# EAGLE design GH_Terra_one_side_corr (EAGLE 6.5.0)
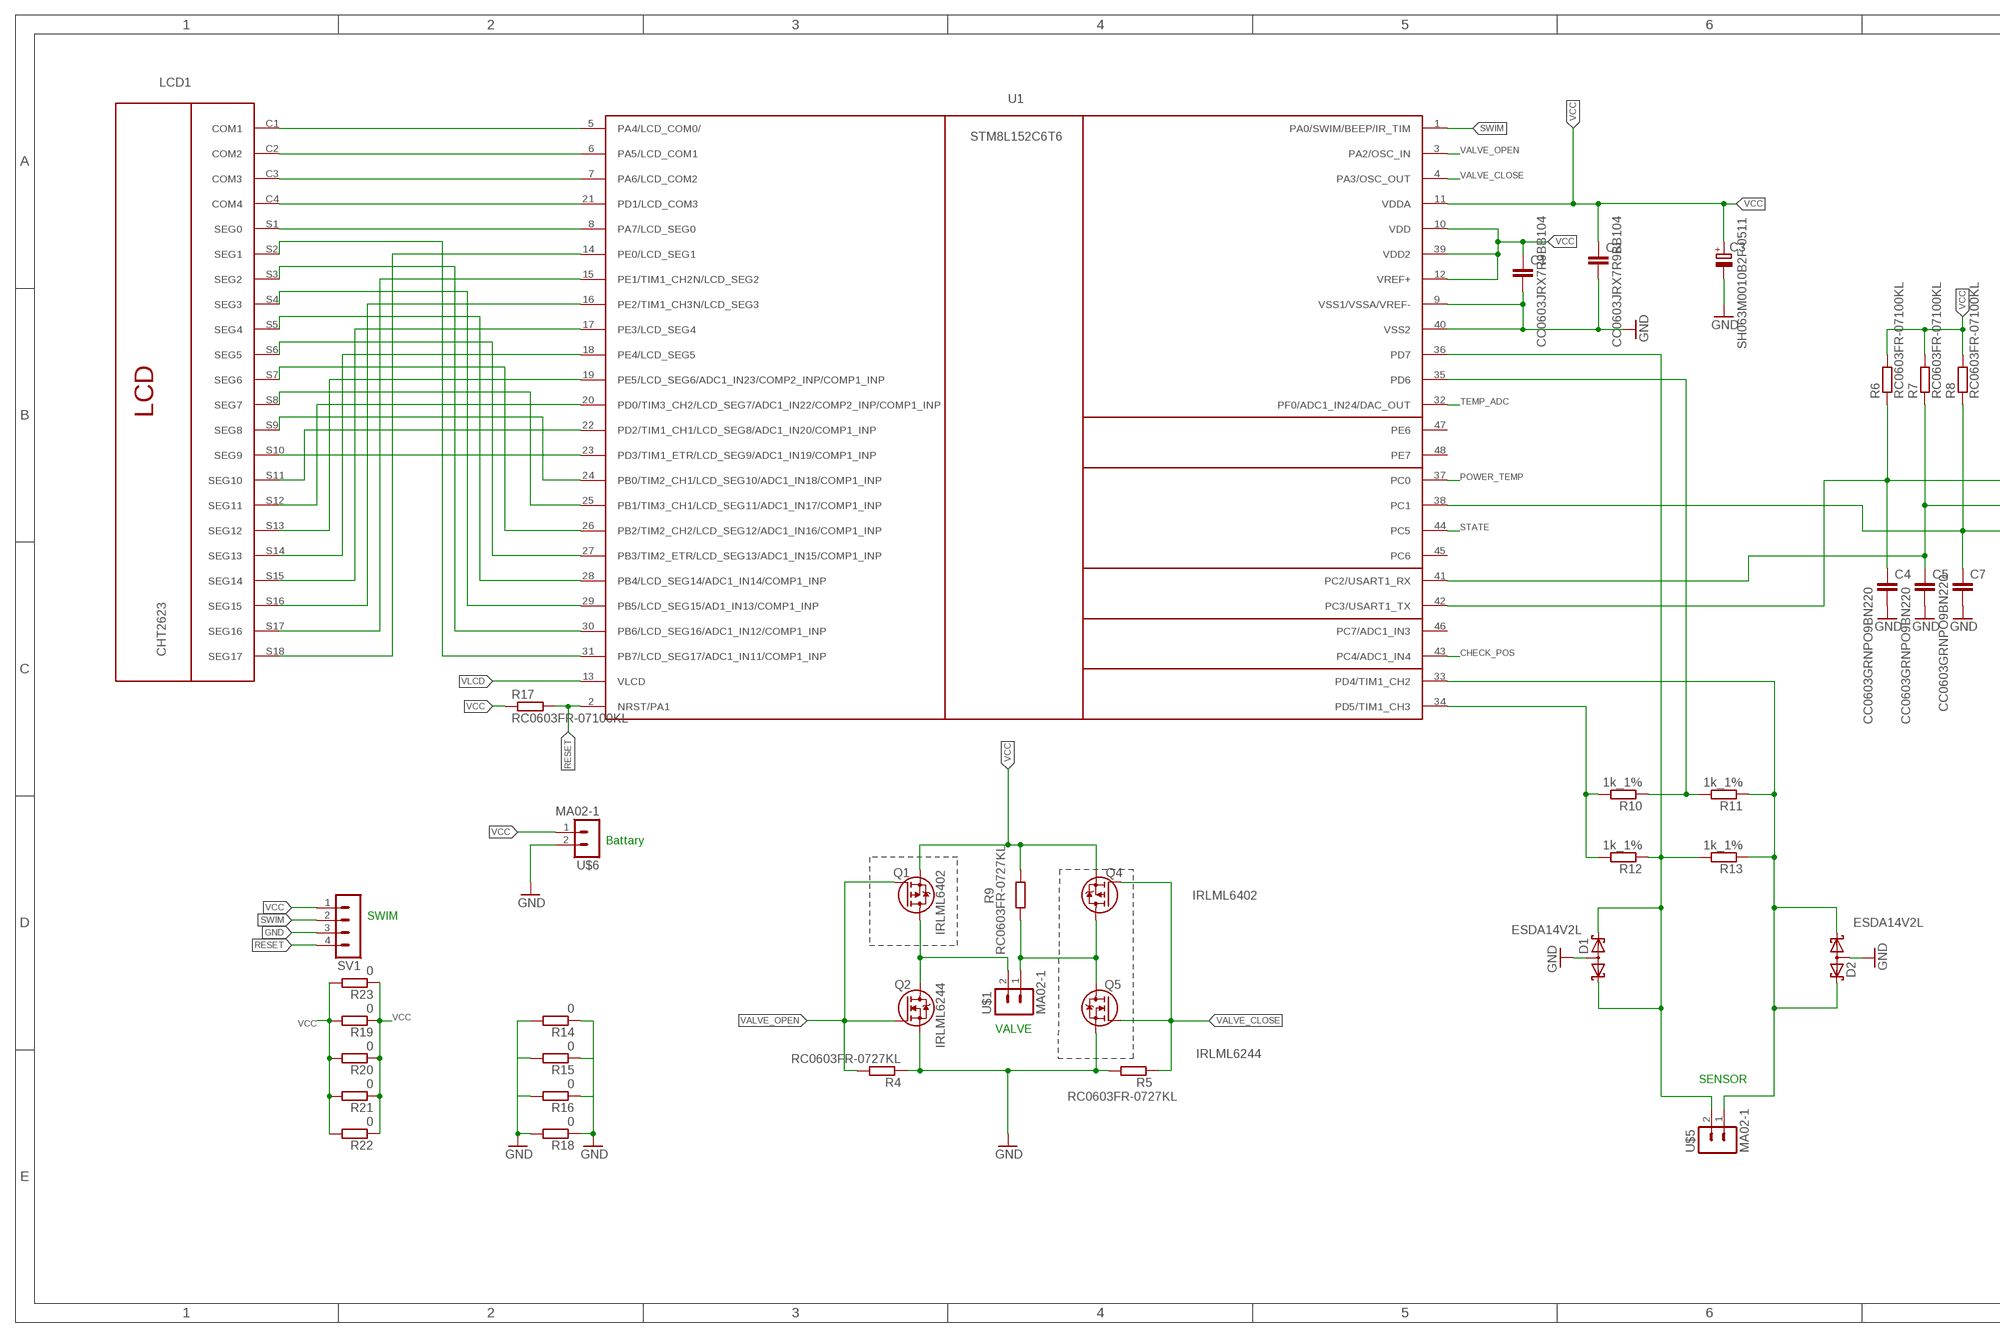
[diagram p0: schematic, sheet 1, part 1 of 2]
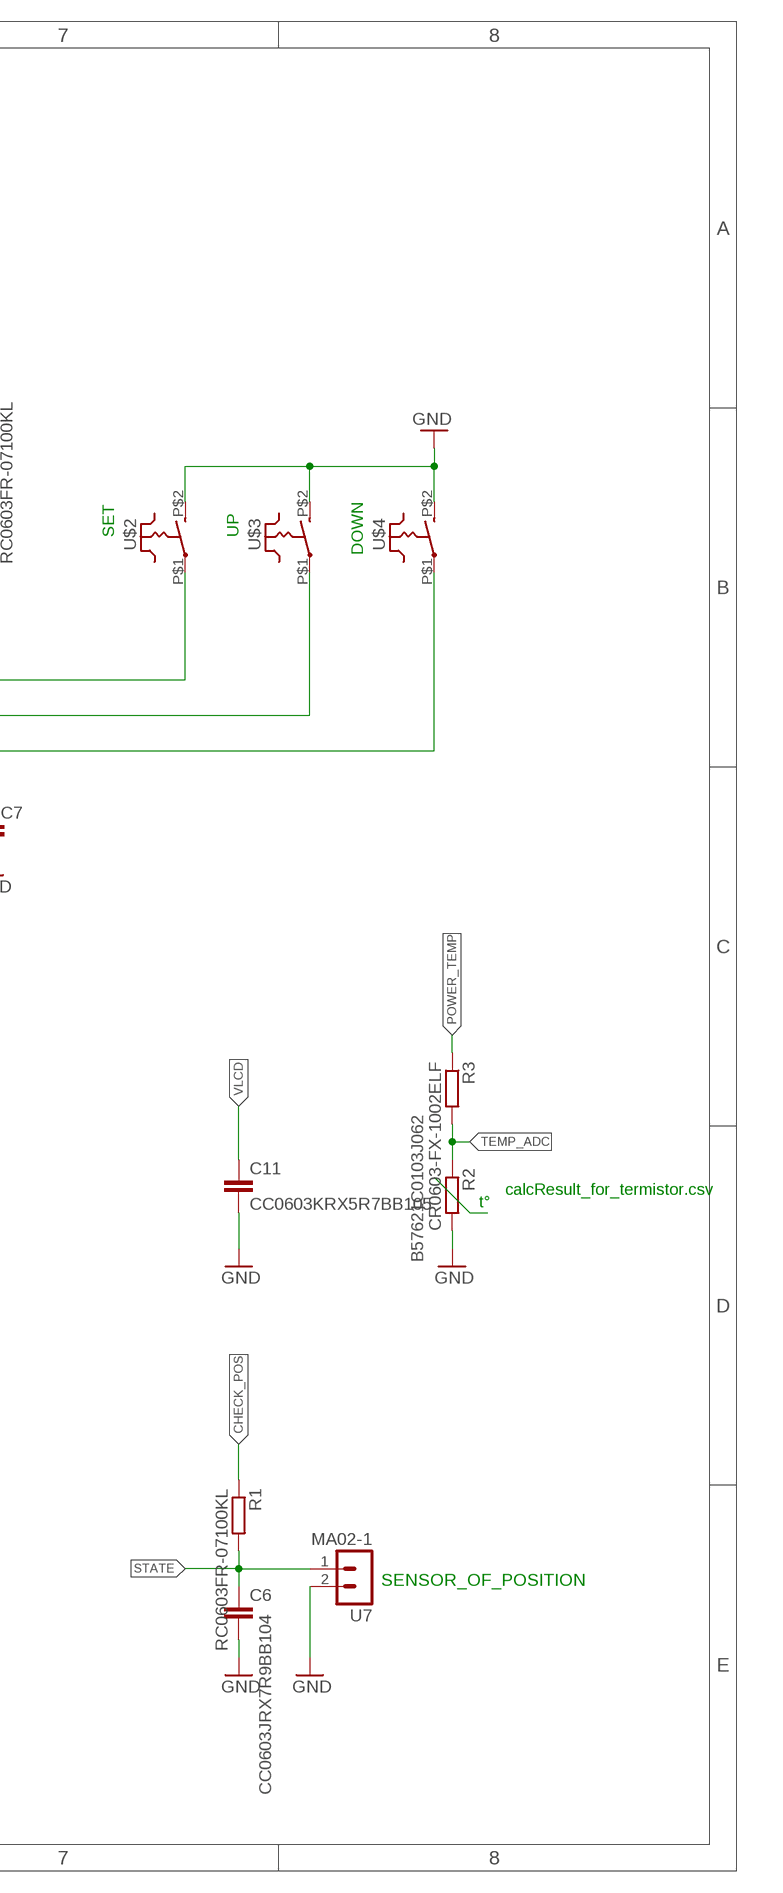
[diagram p1: schematic, sheet 1, part 2 of 2]

## Parts
C1  CC0603JRX7R9BB104  C-EUC0603  [C0603_IPC]
C2  CC0603JRX7R9BB104  C-EUC0603  [C0603_IPC]
C3  SH063M0010B2F-0511  CPOL-EUSANYO_C6  [SANYO-OSCON_C6]
C4  CC0603GRNPO9BN220  C-EUC0603  [C0603_IPC]
C5  CC0603GRNPO9BN220  C-EUC0603  [C0603_IPC]
C6  CC0603JRX7R9BB104  C-EUC0603  [C0603_IPC]
C7  CC0603GRNPO9BN220  C-EUC0603  [C0603_IPC]
C11  CC0603KRX5R7BB105  C-EUC0603  [C0603_IPC]
D1  ESDA14V2L  BAS40-06  [SOT23]
D2  ESDA14V2L  BAS40-06  [SOT23]
LCD1  CHT2623  [CHT2623]
Q1  IRLML6402  PFET-SOT23  [SOT23]
Q2  IRLML6244  NFET-SOT23  [SOT23]
Q4  IRLML6402  PFET-SOT23  [SOT23]
Q5  IRLML6244  NFET-SOT23  [SOT23]
R1  RC0603FR-07100KL  R-EU_R0603  [R0603_IPC]
R2  B57621C0103J062  R-EU_R1206  [R1206]
R3  CR0603-FX-1002ELF  R-EU_R0603  [R0603_IPC]
R4  RC0603FR-0727KL  R-EU_R0603  [R0603_IPC]
R5  RC0603FR-0727KL  R-EU_R0603  [R0603_IPC]
R6  RC0603FR-07100KL  R-EU_R0603  [R0603_IPC]
R7  RC0603FR-07100KL  R-EU_R0603  [R0603_IPC]
R8  RC0603FR-07100KL  R-EU_R0603  [R0603_IPC]
R9  RC0603FR-0727KL  R-EU_R0603  [R0603_IPC]
R10  1k_1%  R-EU_R0603  [R0603_IPC]
R11  1k_1%  R-EU_R0603  [R0603_IPC]
R12  1k_1%  R-EU_R0603  [R0603_IPC]
R13  1k_1%  R-EU_R0603  [R0603_IPC]
R14  0  R-EU_R0603  [R0603_IPC]
R15  0  R-EU_R0603  [R0603_IPC]
R16  0  R-EU_R0603  [R0603_IPC]
R17  RC0603FR-07100KL  R-EU_R0603  [R0603_IPC]
R18  0  R-EU_R0603  [R0603_IPC]
R19  0  R-EU_R0603  [R0603_IPC]
R20  0  R-EU_R0603  [R0603_IPC]
R21  0  R-EU_R0603  [R0603_IPC]
R22  0  R-EU_R0603  [R0603_IPC]
R23  0  R-EU_R0603  [R0603_IPC]
SV1  MA04-1  [MA04-1]
U1  STM8L152C6T6  STM8L152C6  [LQFP48]
U7  MA02-1  [MA02-1]
U$1  MA02-1  [MA02-1]
U$2  RK_4X3  [RK_3X4]
U$3  RK_4X3  [RK_3X4]
U$4  RK_4X3  [RK_3X4]
U$5  MA02-1  [MA02-1]
U$6  MA02-1  [MA02-1]

## Nets
CHECK_POS: R1.1 U1.43(PC4/ADC1_IN4)
GND: C1.2 C2.2 C3.- C4.2 C5.2 C6.2 C7.2 C11.2 D1.3(AA) D2.3(AA) Q2.2(S) Q5.2(S) R2.2 R4.1 R5.2 R14.1 R14.2 R15.1 R15.2 R16.1 R16.2 R18.1 R18.2 SV1.3 U1.9(VSS1/VSSA/VREF-) U1.40(VSS2) U7.2 U$2.P$2(S) U$3.P$2(S) U$4.P$2(S) U$6.2
N$1: LCD1.C1(COM1) U1.5(PA4/LCD_COM0/)
N$2: Q1.3(D) Q2.3(D) U$1.2
N$3: Q4.3(D) Q5.3(D) R9.2 U$1.1
N$4: LCD1.C2(COM2) U1.6(PA5/LCD_COM1)
N$6: LCD1.C3(COM3) U1.7(PA6/LCD_COM2)
N$7: LCD1.C4(COM4) U1.21(PD1/LCD_COM3)
N$8: LCD1.S1(SEG0) U1.8(PA7/LCD_SEG0)
N$9: LCD1.S17(SEG16) U1.15(PE1/TIM1_CH2N/LCD_SEG2)
N$10: LCD1.S16(SEG15) U1.16(PE2/TIM1_CH3N/LCD_SEG3)
N$11: LCD1.S15(SEG14) U1.17(PE3/LCD_SEG4)
N$12: LCD1.S14(SEG13) U1.18(PE4/LCD_SEG5)
N$13: LCD1.S13(SEG12) U1.19(PE5/LCD_SEG6/ADC1_IN23/COMP2_INP/COMP1_INP)
N$14: LCD1.S12(SEG11) U1.20(PD0/TIM3_CH2/LCD_SEG7/ADC1_IN22/COMP2_INP/COMP1_INP)
N$15: LCD1.S11(SEG10) U1.22(PD2/TIM1_CH1/LCD_SEG8/ADC1_IN20/COMP1_INP)
N$16: LCD1.S10(SEG9) U1.23(PD3/TIM1_ETR/LCD_SEG9/ADC1_IN19/COMP1_INP)
N$17: LCD1.S9(SEG8) U1.24(PB0/TIM2_CH1/LCD_SEG10/ADC1_IN18/COMP1_INP)
N$18: LCD1.S8(SEG7) U1.25(PB1/TIM3_CH1/LCD_SEG11/ADC1_IN17/COMP1_INP)
N$19: LCD1.S7(SEG6) U1.26(PB2/TIM2_CH2/LCD_SEG12/ADC1_IN16/COMP1_INP)
N$20: LCD1.S6(SEG5) U1.27(PB3/TIM2_ETR/LCD_SEG13/ADC1_IN15/COMP1_INP)
N$21: LCD1.S5(SEG4) U1.28(PB4/LCD_SEG14/ADC1_IN14/COMP1_INP)
N$22: LCD1.S4(SEG3) U1.29(PB5/LCD_SEG15/AD1_IN13/COMP1_INP)
N$23: LCD1.S3(SEG2) U1.30(PB6/LCD_SEG16/ADC1_IN12/COMP1_INP)
N$24: LCD1.S2(SEG1) U1.31(PB7/LCD_SEG17/ADC1_IN11/COMP1_INP)
N$25: LCD1.S18(SEG17) U1.14(PE0/LCD_SEG1)
N$27: D2.1(K1) D2.2(K2) R11.1 R13.1 U1.33(PD4/TIM1_CH2) U$5.1
N$28: R10.2 R12.2 U1.34(PD5/TIM1_CH3)
N$30: C4.1 R6.1 U1.42(PC3/USART1_TX) U$2.P$1(P)
N$31: C5.1 R7.1 U1.41(PC2/USART1_RX) U$3.P$1(P)
N$32: C7.1 R8.1 U1.38(PC1) U$4.P$1(P)
POWER_TEMP: R3.1 U1.37(PC0)
RESET: R17.2 SV1.4 U1.2(NRST/PA1)
STATE: C6.1 R1.2 U1.44(PC5) U7.1
SWIM: SV1.2 U1.1(PA0/SWIM/BEEP/IR_TIM)
TEMP_ADC: R2.1 R3.2 U1.32(PF0/ADC1_IN24/DAC_OUT)
VALVE_CLOSE: Q4.1(G) Q5.1(G) R5.1 U1.4(PA3/OSC_OUT)
VALVE_OPEN: Q1.1(G) Q2.1(G) R4.2 U1.3(PA2/OSC_IN)
VCC: C1.1 C2.1 C3.+ Q1.2(S) Q4.2(S) R6.2 R7.2 R8.2 R9.1 R17.1 R19.1 R19.2 R20.1 R20.2 R21.1 R21.2 R22.1 R22.2 R23.1 R23.2 SV1.1 U1.10(VDD) U1.11(VDDA) U1.12(VREF+) U1.39(VDD2) U$6.1
VLCD: C11.1 U1.13(VLCD)
VREF: R10.1 R11.2 U1.35(PD6)
VREF1: D1.1(K1) D1.2(K2) R12.1 R13.2 U1.36(PD7) U$5.2
Unconnected: U1.45(PC6) U1.46(PC7/ADC1_IN3) U1.47(PE6) U1.48(PE7)

## Notes on the sheet
- SET | UP
- DOWN
- Battary | calcResult_for_termistor.csv
- t°
- SWIM
- VALVE
- SENSOR
- SENSOR_OF_POSITION

## Library data of the parts
C1 C2 C4-C7 C11 = rcl:C-EU: CAPACITOR, European symbol
C3 = rcl:CPOL-EU: POLARIZED CAPACITOR, European symbol
D1 D2 = diode:BAS40-06: Silicon Schottky Diodes General-purpose diode for high-speed switching
LCD1 = lcd_glass:CHT2623
Q1 Q4 = semiconductor:PFET-
Q2 Q5 = semiconductor:NFET-
R1-R23 = rcl:R-EU_: RESISTOR, European symbol Reflow soldering profile
SV1 = con-lstb:MA04-1: PIN HEADER
U1 = st-microelectronics:STM8L152C6
U7 U$1 U$5 U$6 = con-lstb:MA02-1
U$2-U$4 = rubber_key:RK_4X3

## Board
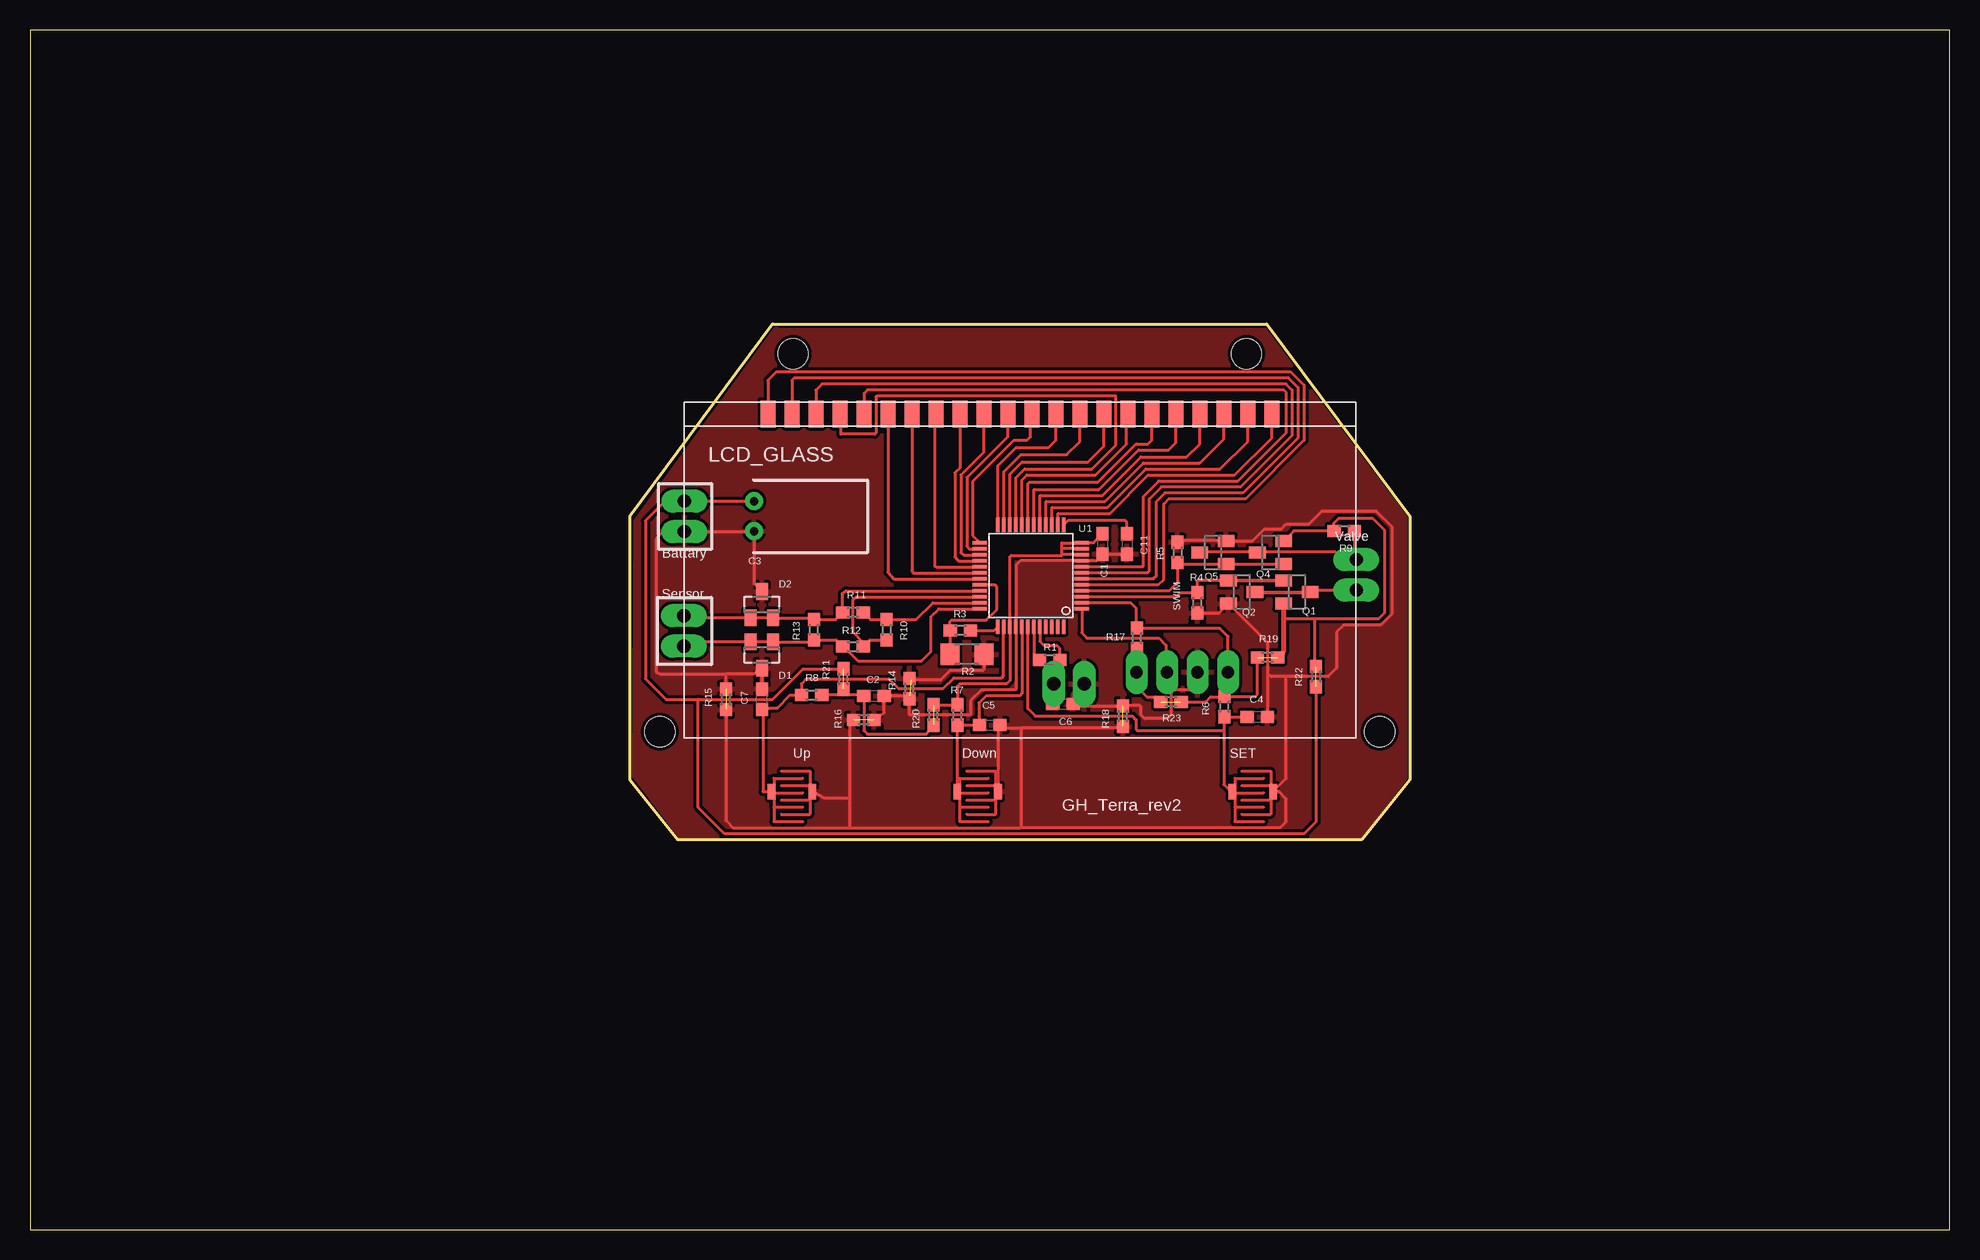
[diagram p2: board, top side]
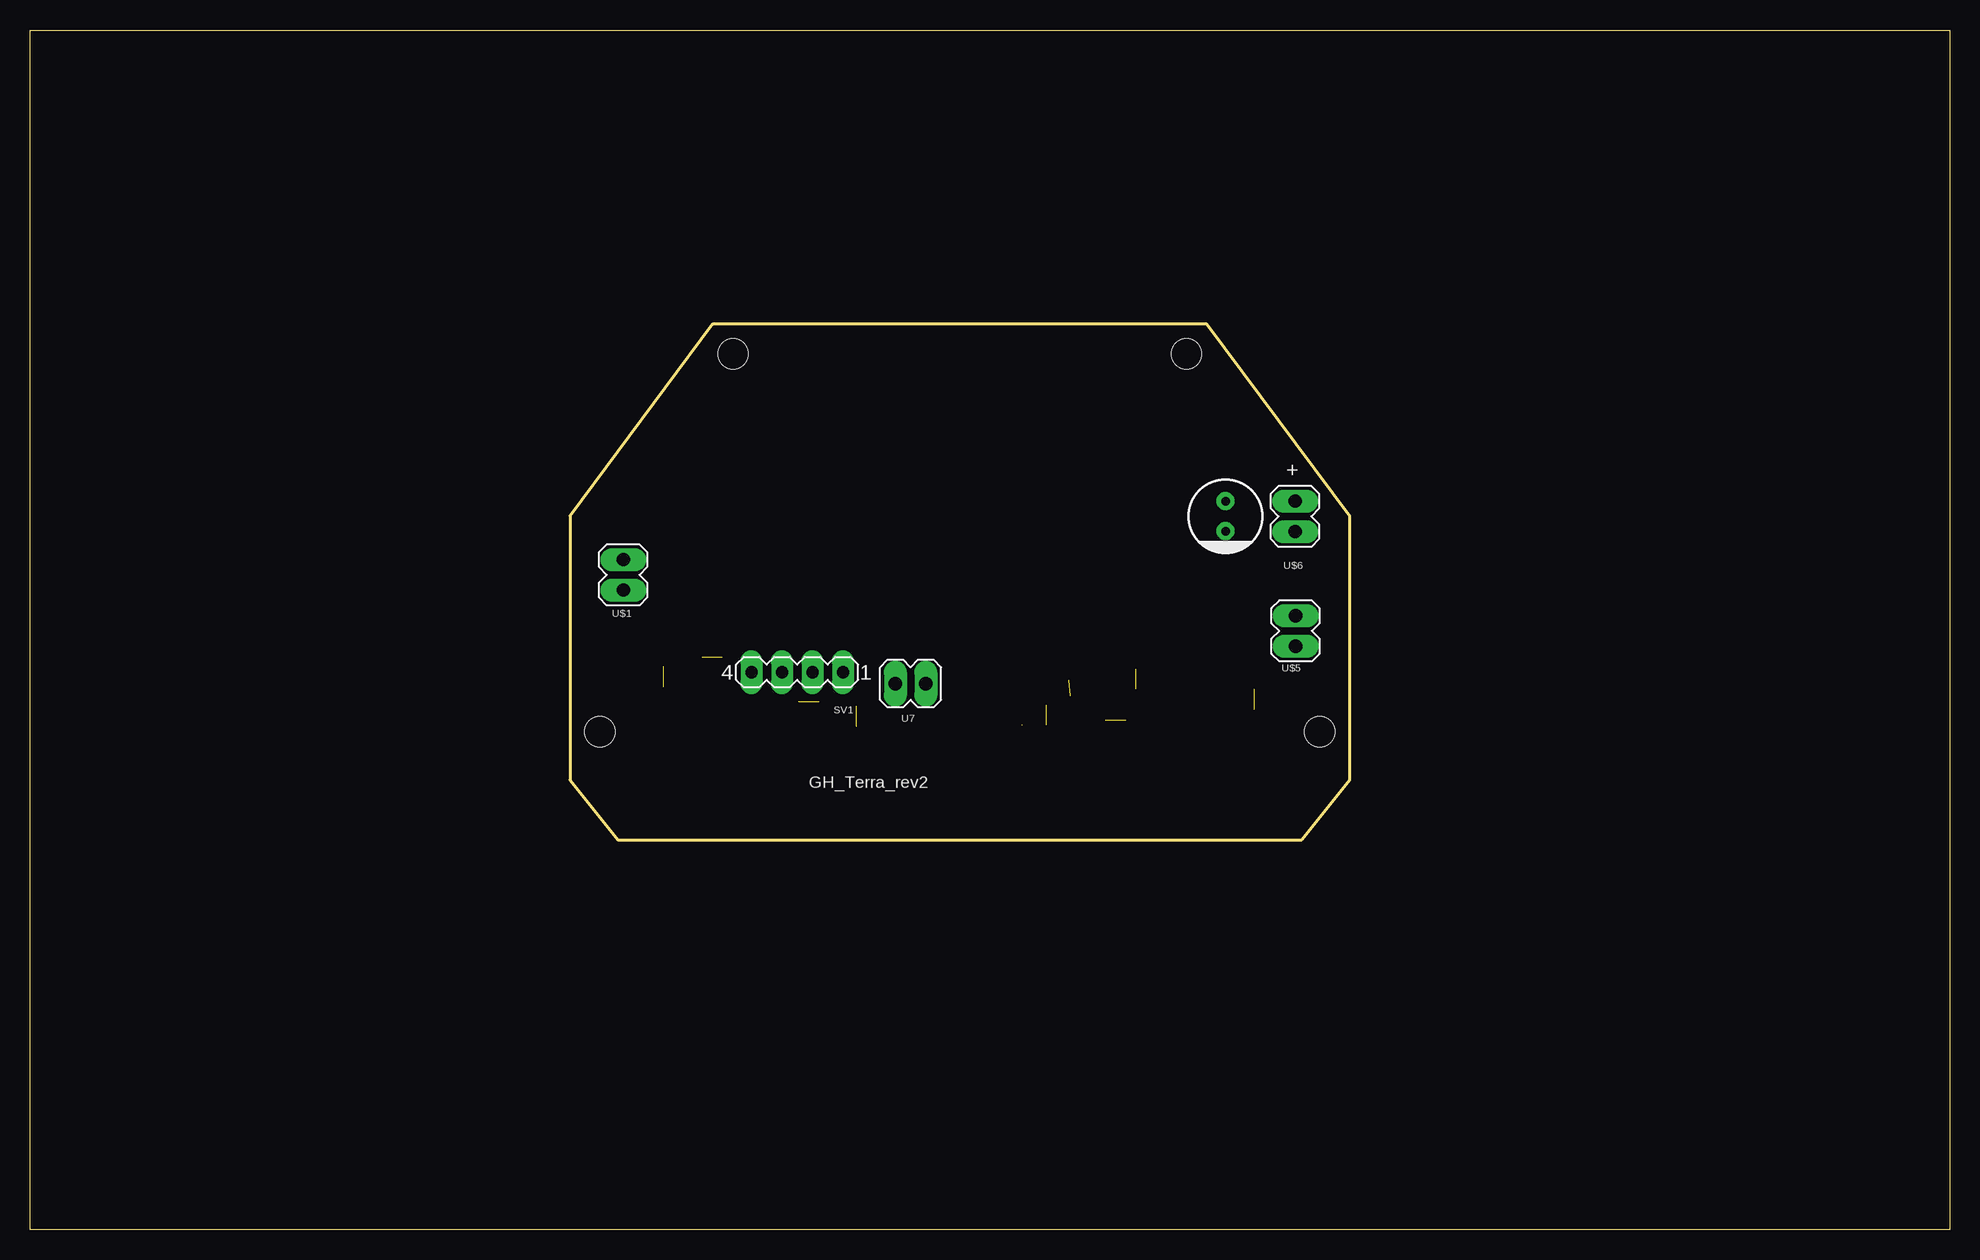
[diagram p3: board, bottom side, seen from below]

Size 160 x 100 mm. Coordinates in mm from the lower left corner, seen from the top.
Outline: 0,0 160,0 160,100 0,100 0,0
Copper layers (1+16): Top 0.018mm / dielectric 1.5mm / Bottom 0.018mm
Design rules "sktb Nauka Design Rules": minimum track width 0.3mm, minimum drill 0.45mm, track to track 0.25mm, track to pad 0.25mm, pad to pad 0.25mm, via to via 0.25mm, smd to smd 0.25mm, copper to edge 0.3mm, drill to drill 0.3mm, minimum pad ring 0.4mm, minimum via ring 0.4mm, stop-mask expansion 0.08mm, vias tented up to drill 0.45mm, thermal gap 0.25mm
Holes 2.5 mm at 112.5,41.5 52.5,41.5 101.4,73 63.6,73
Milling: 8 lines

### Footprints (pad centres in the part's own frame; a part is rotated, then mirrored left to right if it is on the bottom)
C0603_IPC = smd 1.1 x 1: 1 -0.85,0; 2 0.85,0
SANYO-OSCON_C6 = drill 0.7 pad 1.27: + 1.25,0; - -1.25,0
SOT23 = smd 1 x 1.4: 1 -0.95,-1.1; 2 0.95,-1.1; 3 0,1.1
CHT2623 = smd 1.25 x 2.25: C1 7,27; C2 9,27; C3 11,27; C4 13,27; S1 15,27; S2 17,27; S3 19,27; S4 21,27; S5 23,27; S6 25,27; S7 27,27; S8 29,27; S9 31,27; S10 33,27; S11 35,27; S12 37,27; S13 39,27; S14 41,27; S15 43,27; S16 45,27; S17 47,27; S18 49,27
R0603_IPC = smd 1.1 x 1: 1 -0.85,0; 2 0.85,0
R1206 = smd 1.6 x 1.803: 1 -1.422,0; 2 1.422,0
MA04-1 = drill 1.016 long: 1 -3.81,0; 2 -1.27,0; 3 1.27,0; 4 3.81,0
LQFP48 = smd 0.3 x 1.2: 1 -2.75,-4.25; 2 -2.25,-4.25; 3 -1.75,-4.25; 4 -1.25,-4.25; 5 -0.75,-4.25; 6 -0.25,-4.25; 7 0.25,-4.25; 8 0.75,-4.25; 9 1.25,-4.25; 10 1.75,-4.25; 11 2.25,-4.25; 12 2.75,-4.25; 25 2.75,4.25; 26 2.25,4.25; 27 1.75,4.25; 28 1.25,4.25; 29 0.75,4.25; 30 0.25,4.25; 31 -0.25,4.25; 32 -0.75,4.25; 33 -1.25,4.25; 34 -1.75,4.25; 35 -2.25,4.25; 36 -2.75,4.25 | smd 1.2 x 0.3: 13 4.25,-2.75; 14 4.25,-2.25; 15 4.25,-1.75; 16 4.25,-1.25; 17 4.25,-0.75; 18 4.25,-0.25; 19 4.25,0.25; 20 4.25,0.75; 21 4.25,1.25; 22 4.25,1.75; 23 4.25,2.25; 24 4.25,2.75; 37 -4.25,2.75; 38 -4.25,2.25; 39 -4.25,1.75; 40 -4.25,1.25; 41 -4.25,0.75; 42 -4.25,0.25; 43 -4.25,-0.25; 44 -4.25,-0.75; 45 -4.25,-1.25; 46 -4.25,-1.75; 47 -4.25,-2.25; 48 -4.25,-2.75
MA02-1 = drill 1.1 long: 1 -1.27,0; 2 1.27,0
RK_3X4 = smd 0.635 x 1.27: P$1 -0.2,-1.7; P$2 3.2,-1.7

### Placement (x,y rotation side)
C1  89.4,57.15 270 top
C2  70.35,44.5 0 top
C3  60.35,59.47 90 bottom
C4  102.3,42.75 0 top
C5  80,42.05 0 top
C6  86.1,43.8 0 top
C7  61,44.2 90 top
C11  91.42,57.15 270 top
D1  61,47.9 180 top
D2  61,52.1 0 top
LCD1  54.5,41 0 top
Q1  105.6,53.15 270 top
Q2  101,53.15 270 top
Q4  103.4,56.45 90 top
Q5  98.6,56.45 90 top
R1  85,47.5 0 top
R2  78.1,47.95 0 top
R3  77.55,49.95 180 top
R4  97.3,52.25 90 top
R5  95.65,56.45 90 top
R6  99.55,43.6 90 top
R7  77.3,42.9 90 top
R8  65.15,44.55 0 top
R9  109.55,58.25 0 top
R10  71.4,50 270 top
R11  68.6,51.45 0 top
R12  68.6,48.6 0 top
R13  65.35,50 270 top
R14  73.3,45.1 90 top
R15  58,44.2 90 top
R16  69.5,42.5 0 top
R17  92.25,49.3 90 top
R18  91.1,42.8 90 top
R19  103.15,47.7 0 top
R20  75.3,42.9 90 top
R21  67.8,45.9 90 top
R22  107.2,46.1 90 top
R23  95.1,44 0 top
SV1  96.05,46.46 180 bottom
U1  83.42,54.51 90 top
U7  86.6,45.5 180 bottom
U$1  110.55,54.58 270 bottom
U$2  100.42,38.21 0 top
U$3  77.49,38.21 0 top
U$4  62.01,38.21 0 top
U$5  54.5,49.9 270 bottom
U$6  54.55,59.45 270 bottom

### Tracks (layer width: path | path; a pad name or v marks a point on that pad's centre or on a via)
CHECK_POS
  Top 0.254: U1.43 83.67,47.98 R1.1
GND  (4 unrouted)
  Top 0.254: C5.2 80.69,41.99 U$3.P$2 | 102.92,42.52 C4.2 103.15,46.4 | 61.3,46.5 D1.3 60.7,46.5 60.5,46.5 60.3,46.3 58,46.3 | C5.2 81,41.8 82.6,41.8 | 103.15,46.4 103.15,48.95 Q2.2 99.1,51.4 R4.1 | 104.7,46.1 108.2,46.1 108.9,46.8 108.9,49.8 109.5,50.4 112.6,50.4 113.5,51.3 113.5,58.6 112.2,59.9 107.7,59.9 106.6,58.8 104.7,58.8 104.3,58.4 102.9,58.4 101.9,57.4 Q5.2 | 104.7,46.1 103.45,46.1 103.15,46.4 | D2.3 60.35,53.85 C3.- 60.31,58.18 U$6.2 52.78,58.18 52.2,57.6 52.2,46.5 52.5,46.3 58,46.3 | R18.1 90.85,41.8 82.6,41.8 | U$4.P$2 66.22,36 68.3,36 | R15.2 58,46.3 | R15.1 58,34.1 58.6,33.5 68.3,33.5 | R16.2 70.45,42.6 70.7,42.6 71.2,43.1 C2.2 73.3,44.5 R14.1 73.3,42.9 78.4,42.9 78.4,44.1 79.3,45 82.1,45 82.17,45.07 U1.40 82.2,50.29 82.2,55.4 82.56,55.76 U1.9 87.71,55.75 88.9,55.75 C1.2 C11.2 | R16.1 68.3,42.15 68.3,36 | 82.6,33.5 104.2,33.5 104.7,34 104.7,35.9 104.09,36.51 U$2.P$2 104.7,37.59 104.7,46.1 | 68.3,33.5 82.6,33.5 | 82.6,41.8 82.6,33.5 | 68.3,36 68.3,33.5 | 99.9,57.6 Q5.2 | R5.2 96.1,57.3 96.3,57.5 99.6,57.5 Q5.2 | U7.2 87.87,44.72 C6.2 86.9,43.65 R18.2 91.15,43.7 92.5,43.7 92.6,43.6 92.6,42.9 92.9,42.6 94.8,42.6 95.1,42.9 95.1,44.9 95.2,45 97.2,45 97.32,45.12 SV1.3 | 80.9,42.2 C5.2 | 79.57,48.3 R2.2 79.52,46.72 79.4,46.6 76.7,46.6 75.9,45.8 73.45,45.8 R14.2
  Top 0.305: D1.3 C7.2
  pour Top: 62.2,75.1 62.3,75 102.9,75 114.6,59.4 114.6,37.6 110.9,32.8 54.2,32.8 50.4,37.8 50.5,59.1
N$1
  Top 0.254: LCD1.C1 61.5,70.8 62.2,71.5 105.1,71.5 106.2,70.4 106.2,65.8 101.3,60.9 94.9,60.9 94.5,60.5 94.5,54.2 94.06,53.76 U1.5
N$2
  Top 0.254: Q1.3 Q2.3 102.15,53.1 106.6,53.1 106.81,53.31 U$1.2
N$3
  Top 0.254: 97.65,56.4 Q5.3 97.55,56.5 102.35,56.5 | 102.35,56.5 108.8,56.5 109.45,55.85 U$1.1 110.4,56 R9.2 | 102.35,56.5 Q4.3
N$4
  Top 0.254: LCD1.C2 63.5,70.8 63.7,71 104.9,71 105.7,70.2 105.7,66 101.1,61.4 94.6,61.4 93.9,60.7 93.9,54.5 93.66,54.26 U1.6
N$6
  Top 0.254: LCD1.C3 65.5,70 66,70.5 104.7,70.5 105.2,70 105.2,66.2 100.9,61.9 94.3,61.9 93.3,60.9 93.3,54.9 93.16,54.76 U1.7
N$7
  Top 0.254: U1.21 82.17,62.67 82.9,63.4 88.5,63.4 90.5,65.4 90.5,69.5 70.6,69.5 70.5,69.4 70.5,66.4 70.4,66.3 67.6,66.3 67.6,67.9 LCD1.C4
N$8
  Top 0.254: LCD1.S1 69.5,69.7 69.8,70 104.5,70 104.7,69.8 104.7,66.4 100.7,62.4 94.1,62.4 92.8,61.1 92.8,55.3 92.76,55.26 U1.8
N$9
  Top 0.254: U1.15 85.17,60.17 85.2,60.2 89.8,60.2 93,63.4 99.2,63.4 101.5,65.7 LCD1.S17
N$10
  Top 0.254: U1.16 84.67,60.67 84.7,60.7 89.6,60.7 92.8,63.9 97.5,63.9 99.5,65.9 LCD1.S16
N$11
  Top 0.254: U1.17 84.17,61.17 84.2,61.2 89.4,61.2 92.6,64.4 96.4,64.4 97.5,65.5 LCD1.S15
N$12
  Top 0.254: U1.18 83.67,61.67 83.7,61.7 89.1,61.7 92.4,65 94.9,65 95.5,65.6 LCD1.S14
N$13
  Top 0.254: U1.19 83.17,62.17 83.3,62.3 89,62.3 92.2,65.5 93.2,65.5 93.5,65.8 LCD1.S13
N$14
  Top 0.254: U1.20 82.67,62.47 83.1,62.9 88.8,62.9 91.4,65.5 91.4,67.9 LCD1.S12
N$15
  Top 0.254: U1.22 81.67,62.97 82.7,64 88.2,64 89.5,65.3 LCD1.S11
N$16
  Top 0.254: U1.23 81.17,63.17 82.6,64.6 86.4,64.6 87.5,65.7 LCD1.S10
N$17
  Top 0.254: U1.24 80.67,63.57 80.7,63.7 82.2,65.2 84.9,65.2 85.5,65.8 LCD1.S9
N$18
  Top 0.254: LCD1.S8 83.4,67.9 83.4,66.1 83.1,65.8 82,65.8 78.57,62.37 78.57,57.86 U1.25
N$19
  Top 0.254: LCD1.S7 81.5,66.1 78.1,62.7 78.1,57 78.3,56.75 79.13,56.75 U1.26
N$20
  Top 0.254: LCD1.S6 79.5,64.8 77.6,62.9 77.6,56.4 77.8,56.25 79.11,56.25 U1.27
N$21
  Top 0.254: LCD1.S5 77.5,63.5 77.1,63.1 77.1,56.1 77.4,55.75 79.13,55.75 U1.28
N$22
  Top 0.254: LCD1.S4 75.5,67 75.4,66.9 75.4,55.3 75.5,55.25 79.11,55.25 U1.29
N$23
  Top 0.254: LCD1.S3 73.5,54.9 73.6,54.75 79.13,54.75 U1.30
N$24
  Top 0.254: LCD1.S2 71.5,54.8 72,54.25 79.13,54.25 U1.31
N$25
  Top 0.254: U1.14 85.67,59.67 85.7,59.7 90,59.7 93.2,62.9 100.4,62.9 103.5,66 LCD1.S18
N$27
  Top 0.254: U$5.1 54.67,51 D2.1 D2.2 65.2,51 R13.1 67.15,50.85 R11.1 67.7,51.5 67.7,53 68,53.25 79.13,53.25 U1.33
N$28
  Top 0.254: R10.2 70,49.15 R12.2 69.45,48.95 68.6,49.8 68.6,52.5 68.9,52.75 79.13,52.75 U1.34
N$30
  Top 0.254: R6.1 C4.1 | R6.1 99.5,42.7 | 99.5,42.7 99.4,42.6 | U1.42 83.17,43.43 83.8,42.8 91.9,42.8 92.2,42.5 92.2,41.7 92.3,41.6 99.4,41.6 99.5,41.5 | 99.5,42.7 99.5,41.5 | 99.5,41.5 99.5,37.1 100.09,36.51 U$2.P$1 | 99.5,42.8 R6.1
N$31  (1 unrouted)
  Top 0.254: R7.1 U$3.P$1 | R7.1 C5.1 79.1,42.8 79.1,43.9 79.7,44.5 82.5,44.5 82.67,44.67 U1.41
N$32
  Top 0.254: U$4.P$1 61.11,36.51 61.1,36.5 61.1,43.25 C7.1 61.15,43.5 62.3,43.5 63.35,44.55 R8.1 64.3,45.5 64.7,45.9 71.6,45.9 72.4,45.1 76.1,45.1 77,46 81,46 81.15,46.2 81.15,50.23 U1.38
POWER_TEMP
  Top 0.254: R3.1 80.36,49.95 U1.37
RESET
  Top 0.254: U1.2 91.74,52.26 92.2,51.8 92.2,50.2 R17.2 92.3,50.1 99.2,50.1 99.86,49.44 SV1.4
STATE
  Top 0.254: U1.44 84.17,49.03 84.5,48.7 85.6,48.7 85.8,48.5 85.8,47.55 R1.2 85.85,46.02 U7.1 85.25,45.42 C6.1
SWIM
  Top 0.254: U1.1 87.67,49.73 88.1,49.3 94.1,49.3 94.7,48.7 94.7,46.54 SV1.2
TEMP_ADC
  Top 0.254: R2.1 76.7,47.45 R3.2 76.7,50.7 76.8,50.8 79.7,50.8 80.6,51.7 80.6,53.6 80.4,53.75 79.21,53.75 U1.32
VALVE_CLOSE
  Top 0.254: Q4.1 Q5.1 96.1,55.5 96,55.6 R5.1 95.7,55.55 95.7,54 94.96,53.26 U1.4
VALVE_OPEN
  Top 0.254: Q2.1 Q1.1 97.3,54.1 R4.2 95.9,53.1 95.56,52.76 U1.3
VCC  (5 unrouted)
  Top 0.254: 107.1,50.9 104.7,50.9 104.5,51.1 Q1.2 | C3.+ U$6.1 52.92,60.72 51.3,59.1 51.3,45.9 53,44.2 55.7,44.2 | 66.15,44.4 R8.2 67.8,44.55 | 67.8,44.55 69.45,44.55 C2.1 69.5,41.6 69.8,41.3 74.7,41.3 75.3,41.9 R20.1 | R20.2 R7.2 77.3,45.3 77.5,45.5 81.4,45.5 81.67,45.77 U1.39 81.67,56.07 81.8,56.2 86,56.2 | 55.7,44.2 61.9,44.2 64.45,46.75 R21.2 | R21.1 67.8,44.55 | R22.2 107.1,47.05 107.1,50.9 | R22.1 107.2,34 106.2,33 57.9,33 55.7,35.2 55.7,44.2 | 107.1,50.9 112.4,50.9 112.9,51.4 112.9,58.3 111.9,59.3 109.1,59.3 108.7,58.9 R9.1 105.35,58.25 Q4.2 | R19.1 102.3,44.6 102.15,44.45 R6.2 99.5,44.4 98.4,44.4 98,44 R23.2 | R17.1 SV1.1 92.24,45.26 93.1,44.4 93.85,44.4 R23.1 | 86,56.2 86,56.8 | 86,56.8 86,57.25 87.63,57.25 U1.12 88.66,57.26 C1.1 | U1.11 86.04,56.76 86,56.8 | U1.10 86.06,56.26 86,56.2
  Top 0.406: R19.2 104.5,48.2 Q1.2
VLCD
  Top 0.254: C11.1 91.42,58.98 91.3,59.1 86.51,59.1 U1.13
VREF
  Top 0.254: R11.2 70.05,50.85 R10.1 73.85,50.85 75.25,52.25 U1.35
VREF1
  Top 0.254: U$5.2 54.87,49 D1.2 D1.1 65.2,49 R13.2 67.2,49.15 R12.1 67.8,48.6 69,47.4 74.3,47.4 75.1,48.2 75.1,51.1 75.75,51.75 U1.36

### Text on the board
tPlace: GH_Terra_rev2
bPlace: GH_Terra_rev2
tNames: Valve | Battary | Sensor | SWIM | Up | Down | SET
bNames: +